# Altium schematic sheet Peripherals.SchDoc: Peripherals
size A4; DocumentNumber: MB1219; Revision: B.1; SheetNumber: 12; SheetTotal: 17; Project: STM32F769I-EVAL
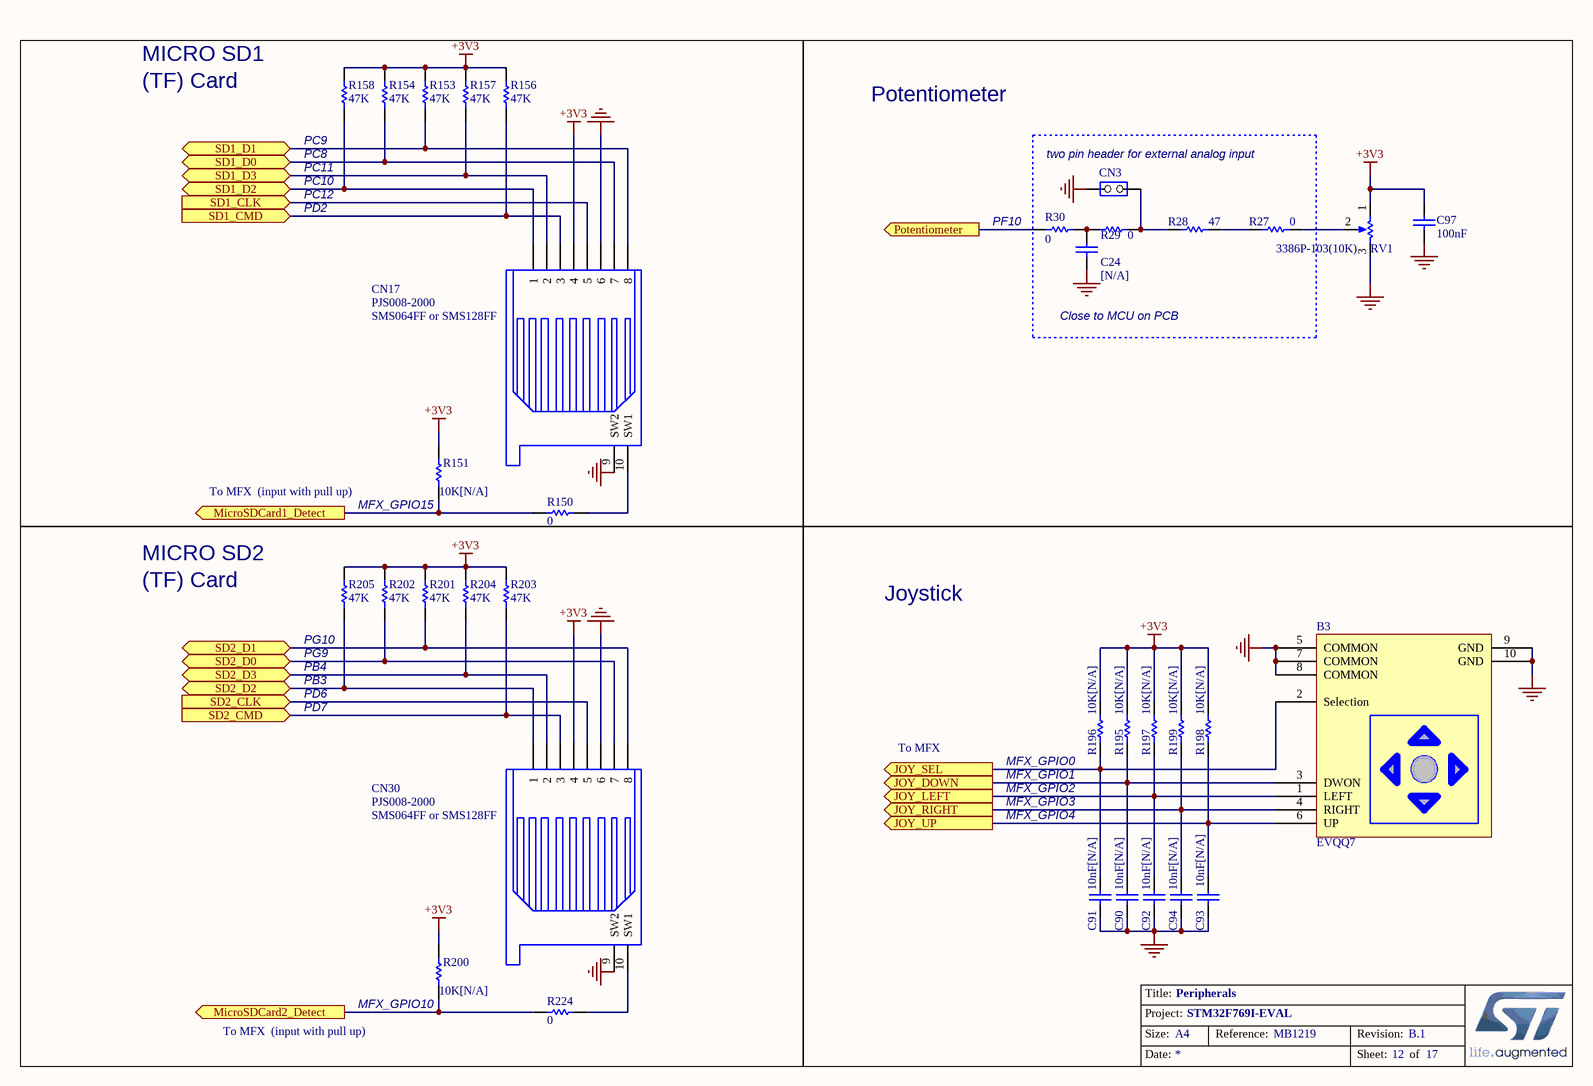
[diagram p0: Peripherals.SchDoc]

## Parts
B3  EVQQ7  [SW-JOY]
C24  [N/A]  [0603C]
C90  10nF[N/A]  [0603C]
C91  10nF[N/A]  [0603C]
C92  10nF[N/A]  [0603C]
C93  10nF[N/A]  [0603C]
C94  10nF[N/A]  [0603C]
C97  100nF  [0603C]
CN3  (no value)  [SIP2]
CN17  PJS008-2000  [MSD_PJS008_]
CN30  PJS008-2000  [MSD_PJS008_]
R27  0  [0603R]
R28  47  [0603R]
R29  0  [0603R]
R30  0  [0603R]
R150  0  [0603R]
R151  10K[N/A]  [0603R]
R153  47K  [0603R]
R154  47K  [0603R]
R156  47K  [0603R]
R157  47K  [0603R]
R158  47K  [0603R]
R195  10K[N/A]  [0603R]
R196  10K[N/A]  [0603R]
R197  10K[N/A]  [0603R]
R198  10K[N/A]  [0603R]
R199  10K[N/A]  [0603R]
R200  10K[N/A]  [0603R]
R201  47K  [0603R]
R202  47K  [0603R]
R203  47K  [0603R]
R204  47K  [0603R]
R205  47K  [0603R]
R224  0  [0603R]
RV1  3386P-103(10K)  [3386P]

## Ports
JOY_DOWN (out), JOY_LEFT (out), JOY_RIGHT (out), JOY_SEL (out), JOY_UP (out), MicroSDCard1_Detect (out), MicroSDCard2_Detect (out), Potentiometer (out), SD1_CLK (in), SD1_CMD (in), SD1_D0 (bidir), SD1_D1 (bidir), SD1_D2 (bidir), SD1_D3 (bidir), SD2_CLK (in), SD2_CMD (in), SD2_D0 (bidir), SD2_D1 (bidir), SD2_D2 (bidir), SD2_D3 (bidir)

## Nets
+3V3: C97.1 CN17.4 CN30.4 R151.2 R153.1 R154.1 R156.1 R157.1 R158.1 R195.1 R196.1 R197.1 R198.1 R199.1 R200.2 R201.1 R202.1 R203.1 R204.1 R205.1 RV1.1(BOT)
GND: B3.5(COMMON) B3.7(COMMON) B3.8(COMMON) B3.9(GND) B3.10(GND) C24.1 C90.1 C91.1 C92.1 C93.1 C94.1 C97.2 CN3.2(NO) CN17.6 CN17.9(SW2) CN30.6 CN30.9(SW2) RV1.3(TOP)
JOY_DOWN: B3.3(DWON) C90.2 R195.2 ; port JOY_DOWN
JOY_LEFT: B3.1(LEFT) C92.2 R197.2 ; port JOY_LEFT
JOY_RIGHT: B3.4(RIGHT) C94.2 R199.2 ; port JOY_RIGHT
JOY_SEL: B3.2(Selection) C91.2 R196.2 ; port JOY_SEL
JOY_UP: B3.6(UP) C93.2 R198.2 ; port JOY_UP
MicroSDCard1_Detect: R150.1 R151.1 ; port MicroSDCard1_Detect
MicroSDCard2_Detect: R200.1 R224.1 ; port MicroSDCard2_Detect
Potentiometer: R30.2 ; port Potentiometer
SD1_CLK: CN17.5 ; port SD1_CLK
SD1_CMD: CN17.3 R156.2 ; port SD1_CMD
SD1_D0: CN17.7 R154.2 ; port SD1_D0
SD1_D1: CN17.8 R153.2 ; port SD1_D1
SD1_D2: CN17.1 R158.2 ; port SD1_D2
SD1_D3: CN17.2 R157.2 ; port SD1_D3
SD2_CLK: CN30.5 ; port SD2_CLK
SD2_CMD: CN30.3 R203.2 ; port SD2_CMD
SD2_D0: CN30.7 R202.2 ; port SD2_D0
SD2_D1: CN30.8 R201.2 ; port SD2_D1
SD2_D2: CN30.1 R205.2 ; port SD2_D2
SD2_D3: CN30.2 R204.2 ; port SD2_D3
NetC24_2: C24.2 R29.1 R30.1
NetCN3_1: CN3.1(COMMON) R28.1 R29.2
NetCN17_10: CN17.10(SW1) R150.2
NetCN30_10: CN30.10(SW1) R224.2
NetR27_1: R27.1 R28.2
NetR27_2: R27.2 RV1.2(TAP)

## Notes on the sheet
- MICRO SD1
- (TF) Card
- (near R158) PC9
- Potentiometer
- (near R158) PC8
- PC10
- PC11
- PC12
- PD2
- (near CN3) two pin header for external analog input
- (near R30) PF10
- (near CN17) SMS064FF or SMS128FF
- Close to MCU on PCB
- To MFX  (input with pull up)
- (near R151) MFX_GPIO15
- MICRO SD2
- Joystick
- (near R205) PG9
- (near R205) PG10
- PB3
- PB4
- PD6
- PD7
- To MFX
- (near CN30) SMS064FF or SMS128FF
- (near R196) MFX_GPIO0
- MFX_GPIO1
- MFX_GPIO2
- MFX_GPIO3
- MFX_GPIO4
- (near R200) MFX_GPIO10
- Title:
- Project:
- Size:
- Date:
- A4
- Reference:
- Sheet:
- Revision:
- of

## Library data of the parts
C24 = cap: Capacitor; Value: 100pF; Published: 8-Jun-2000; Revision: July-2002: Re-released for DXP Platform.; Publisher: Altium Limited
C90-C94 C97 = CAP: Capacitor; Value: 100pF; Published: 8-Jun-2000; Revision: July-2002: Re-released for DXP Platform.; Publisher: Altium Limited
CN3 = JP2
CN17 CN30 = SMS016AFA5E
R27-R30 R150 R151 R200 R224 = Res1: Resistor; Value: 1K; Published: 8-Jun-2000; Revision: July-2002: Re-released for DXP Platform.; Publisher: Altium Limited
R153 R154 R156-R158 R195-R199 R201-R205 = res1: Resistor; Value: 1K; Published: 8-Jun-2000; Revision: July-2002: Re-released for DXP Platform.; Publisher: Altium Limited
RV1 = RV